# Altium schematic sheet P03_ Power Supplies.SchDoc
size A3; SheetNumber: 3; SheetTotal: 7
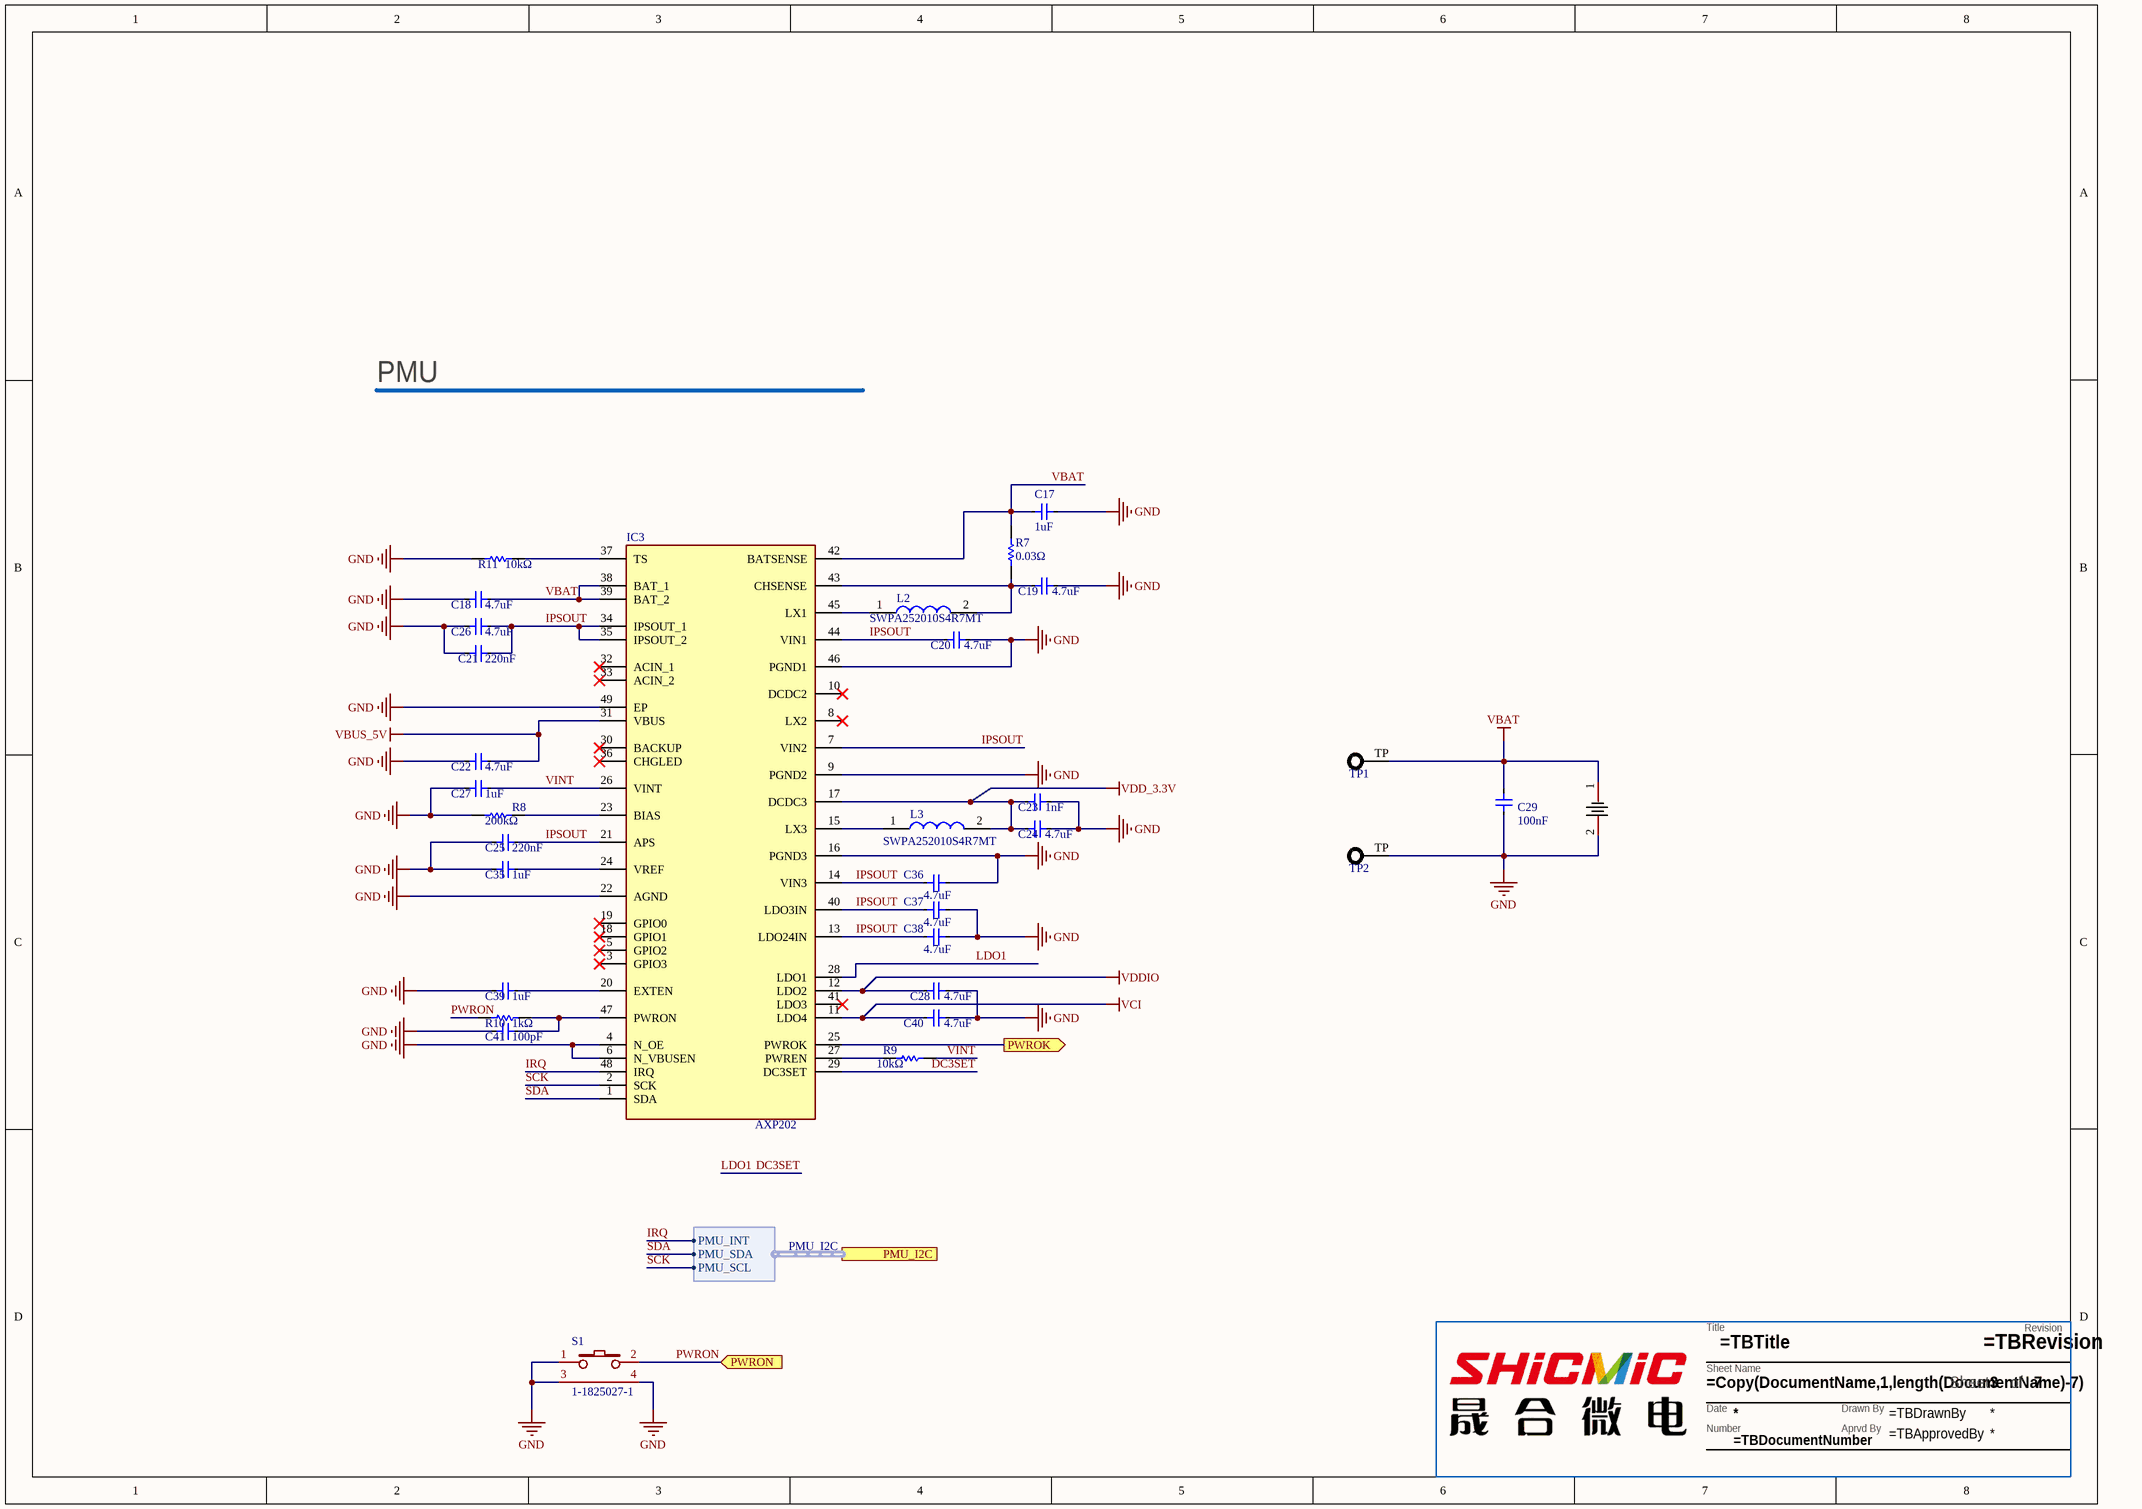
[diagram p0: P03_ Power Supplies.SchDoc]

## Parts
?  TitleBlock  (value not drawn)  (graphical)
BT1  BH-18650-B1BA002  [BATTERY-SMD_18650-1S-L77.1-W20.7-1]  (value not drawn)
C17  1uF  [CAP_0402]
C18  4.7uF  [CAP_0402]
C19  4.7uF  [CAP_0402]
C20  4.7uF  [CAP_0402]
C21  220nF  [CAP_0402]
C22  4.7uF  [CAP_0402]
C23  1nF  [CAP_0402]
C24  4.7uF  [CAP_0402]
C25  220nF  [CAP_0402]
C26  4.7uF  [CAP_0402]
C27  1uF  [CAP_0402]
C28  4.7uF  [CAP_0402]
C29  100nF  [CAP_0402]
C35  1uF  [CAP_0402]
C36  4.7uF  [CAP_0402]
C37  4.7uF  [CAP_0402]
C38  4.7uF  [CAP_0402]
C39  1uF  [CAP_0402]
C40  4.7uF  [CAP_0402]
C41  100pF  [CAP_0402]
IC3  AXP202  [QFN40P600X600X80-49N-D]
L2  SWPA252010S4R7MT  [SWPA252010S4R7MT]
L3  SWPA252010S4R7MT  [SWPA252010S4R7MT]
R7  0.03Ω  [RESC2013X58N]
R8  200kΩ  [RES_0402]
R9  10kΩ  [RES_0402]
R10  1kΩ  [RES_0402]
R11  10kΩ  [RES_0402]
S1  1-1825027-1  [1825027-5]
TP1  PAD  [TPPAD_1.0mm]  (value not drawn)  (no BOM)
TP2  PAD  [TPPAD_1.0mm]  (value not drawn)  (no BOM)

## Ports
PMU_I2C (harness PMU_I2C), PWROK (out), PWRON (in)

## Harnesses
PMU_I2C: PMU_SCL, PMU_SDA, PMU_INT

## Nets
GND: BT1.2 C17.1 C18.1 C19.1 C20.1 C21.1 C22.1 C23.1 C24.1 C25.1 C26.1 C27.1 C28.1 C29.2 C35.1 C36.1 C37.1 C38.1 C39.1 C40.1 C41.1 IC3.4(N_OE) IC3.6(N_VBUSEN) IC3.9(PGND2) IC3.16(PGND3) IC3.22(AGND) IC3.46(PGND1) IC3.49(EP) R8.1 R11.1 S1.1 S1.3(MH1) S1.4(MH2) TP2.TP
VBAT: BT1.1 C17.2 C18.2 C29.1 IC3.38(BAT_1) IC3.39(BAT_2) IC3.42(BATSENSE) R7.2 TP1.TP
VBUS_5V: C22.2 IC3.31(VBUS)
VCI: C40.2 IC3.11(LDO4)
VDD_3.3V: C23.2 C24.2 IC3.17(DCDC3) L3.2
VDDIO: C28.2 IC3.12(LDO2)
DC3SET: IC3.28(LDO1) IC3.29(DC3SET)  [also labelled LDO1]
IPSOUT: C20.2 C21.2 C25.2 C26.2 C36.2 C37.2 C38.2 IC3.7(VIN2) IC3.13(LDO24IN) IC3.14(VIN3) IC3.21(APS) IC3.34(IPSOUT_1) IC3.35(IPSOUT_2) IC3.40(LDO3IN) IC3.44(VIN1)
IRQ: IC3.48(IRQ) ; port PMU_I2C.PMU_INT
PWROK: IC3.25(PWROK) ; port PWROK
PWRON: R10.1 S1.2 ; port PWRON
SCK: IC3.2(SCK) ; port PMU_I2C.PMU_SCL
SDA: IC3.1(SDA) ; port PMU_I2C.PMU_SDA
VINT: C27.2 IC3.26(VINT) R9.1
NetC19_2: C19.2 IC3.43(CHSENSE) L2.2 R7.1
NetC35_2: C35.2 IC3.24(VREF)
NetC39_2: C39.2 IC3.20(EXTEN)
NetC41_2: C41.2 IC3.47(PWRON) R10.2
NetIC3_15: IC3.15(LX3) L3.1
NetIC3_23: IC3.23(BIAS) R8.2
NetIC3_27: IC3.27(PWREN) R9.2
NetIC3_37: IC3.37(TS) R11.2
NetIC3_45: IC3.45(LX1) L2.1

Not connected (* = marked no-connect by the designer): IC3 3(GPIO3)* 5(GPIO2)* 8(LX2)* 10(DCDC2)* 18(GPIO1)* 19(GPIO0)* 30(BACKUP)* 32(ACIN_1)* 33(ACIN_2)* 36(CHGLED)* 41(LDO3)*

## Notes on the sheet
- PMU
- (in symbol TitleBlock) Revision; Title; Sheet Name; Sheet; of; Date; Drawn By; Number; Aprvd By

## Library data of the parts
? = TitleBlock: Title block for Ambiq Schematics. Please have the following parameters entered in Project>Project Options>Parameters: / TBTitle / TBDocumentNumber / TBRevision / TBDrawnBy / TBApprovedBy; AMBIQ PN: TitleBlock
BT1 = BH-18650-B1BA002: Manufacturer: MYOUNG(美阳); Add into BOM: yes; Connector Type: 电池盒; Battery Type: 18650; Name: BH-18650-B1BA002; Symbol: BH-18650-B1BA002; Device: BH-18650-B1BA002; LCSC Part Name: 电池盒 适用电池:18650; Supplier Part: C2988620; Manufacturer Part: BH-18650-B1BA002; Supplier Footprint: SMD; JLCPCB Part Class: Extended Part; Datasheet: https://atta.szlcsc.com/upload/public/pdf/source/20220402/870DB99AB50CA0DF8D51CF7C86A51FAB.pdf; Supplier: LCSC; Convert to PCB: yes
C17-C28 C35-C41 = Capacitor: NONE; Manufacturer: Samsung; AMBIQ PN: CL05A225KP5NNNC; Capacitance: 2.2uF; Tolerance: 10%; Voltage Rating: 10V; Supplier 1: Arrow Electronics; Supplier Part Number 1: CL05A225KP5NNNC; Manufacturer Part Number: CL05A225KP5NNNC; RoHS: Yes; Category: Ceramic Capacitors; Stock 1: 32414; Pricing 1: 1=0.14620, 10=0.09980, 25=0.09880, 100=0.05200, 250=0.05150, 500=0.03630, 1000=0.02990, 3000=0.02760, 6000=0.02610, 15000=0.023; Mount: Surface Mount; Case/Package: 0402; Case Code (Metric): 1005; Case Code (Imperial): 0402; Min Operating Temperature: -55°C; Max Operating Temperature: 85°C; Packaging: Tape and Reel; Voltage Rating (DC): 10V; Series: CL; Length: 0.039inch; Width: 0.02inch; Thickness: 0.022inch; RoHS Compliant: Yes; ComponentLink1URL: https://datasheet.ciiva.com/25727/cl05a225kp5nnnc-25727777.pdf?src-supplier=Digi-Key; ComponentLink1Description: https://datasheet.ciiva.com/25727/cl05a225kp5nnnc-25727777.pdf?src-supplier=Digi-Key; Package Quantity: 1
C29 = Capacitor: NONE; Manufacturer: Kyocera AVX; AMBIQ PN: 0201ZD104KAT2A; Tolerance: 10%; Voltage Rating: 10V; Supplier 1: Arrow Electronics; Supplier Part Number 1: 0201ZD104KAT2A; Manufacturer Part Number: 0201ZD104KAT2A; RoHS: Yes; Category: Ceramic Capacitors; Stock 1: 105000; Pricing 1: 15000=0.00770, 30000=0.00750, 45000=0.00740, 60000=0.00720, 75000=0.00690, 150000=0.00620 (USD); Mount: Surface Mount; Case/Package: 0201; Case Code (Metric): 0603; Case Code (Imperial): 0201; Min Operating Temperature: -55°C; Max Operating Temperature: 85°C; Capacitance: 100nF; Packaging: Tape and Reel; Voltage Rating (DC): 10V; Series: -; Lead Free: Lead Free; RoHS Compliant: Yes; ComponentLink1URL: http://www.mouser.com/ds/2/40/cx5r-776519.pdf?src-supplier=Mouser; ComponentLink1Description: http://www.mouser.com/ds/2/40/cx5r-776519.pdf?src-supplier=Mouser
IC3 = AXP202: Integrated Circuit; Manufacturer_Name: X-Powers; Datasheet Link: http://www.x-powers.com/en.php/Info/down/id/55; Height: 0.8mm; Manufacturer_Part_Number: AXP202
L2 L3 = SWPA252010S4R7MT: Inductor; Manufacturer_Name: SUNLORD; Datasheet Link: https://www.sunlordinc.com/Download.aspx?file=L1VwbG9hZEZpbGVzL1BERl9DYXQvMjAyMjA2MDcxMDAxMzg2MzEucGRm&lan=en; Height: 1mm; Manufacturer_Part_Number: SWPA252010S4R7MT
R7 = WSL0805R0300FEA18: Resistor; Manufacturer_Name: Vishay; Datasheet Link: https://www.vishay.com/docs/31057/wslhigh.pdf; Height: 0.584mm; Manufacturer_Part_Number: WSL0805R0300FEA18; Mouser Part Number: 71-WSL0805R0300FEA18; Mouser Price/Stock: https://www.mouser.co.uk/ProductDetail/Vishay-Dale/WSL0805R0300FEA18?qs=Dk6UgDv3OKgnZ05Ewij84g%3D%3D
R8-R11 = Resistor: Surface Mount Thick Film Resistor, Rc Series, 10 Kohm, 62.5 Mw, - 1%, 50 V, 0402 [1005 Metric]; Manufacturer: Yageo; AMBIQ PN: RC0402FR-0710KL; Resistance: 10kR; Power Rating: 62.5mW; Voltage Rating: 50V; Max Power Dissipation: 63mW; Temperature Coefficient: 100ppm/°C; Supplier 1: Arrow Electronics; Supplier Part Number 1: RC0402FR-0710KL; Manufacturer Part Number: RC0402FR-0710KL; RoHS: Yes; Category: Chip SMD Resistors; Stock 1: 7776428; Pricing 1: 10000=0.00210 (USD); Case/Package: 0402; Case Code (Metric): 1005; Case Code (Imperial): 0402; Min Operating Temperature: -55°C; Max Operating Temperature: 155°C; Packaging: Tape and Reel; Resistor Type: Thick Film; Number of Terminations: 2; Termination: SMD/SMT; Voltage Rating (DC): 50V; Features: Moisture Resistant; Series: RC; Construction: Rectangular; Length: 1mm; Width: 0.5mm; Height: 0.32mm; Depth: 0.5mm; REACH SVHC: No SVHC; Military Standard: Not; Lead Free: Lead Free; RoHS Compliant: Yes; ComponentLink1URL: https://datasheet.ciiva.com/7660/38568-7660787.pdf?src-supplier=Element14; ComponentLink1Description: https://datasheet.ciiva.com/7660/38568-7660787.pdf?src-supplier=Element14; ComponentLink2URL: https://datasheet.ciiva.com/7849/1686128-7849814.pdf?src-supplier=Element14; ComponentLink2Description: https://datasheet.ciiva.com/7849/1686128-7849814.pdf?src-supplier=Element14; ComponentLink3URL: https://datasheet.ciiva.com/7983/1018594-7983486.pdf?src-supplier=Element14; Tolerance: 1%; Number of Pins: 2; Resistance Tolerance: 1%; Working Voltage: 50V; Lead Pitch: 0.2mm
S1 = 1-1825027-1: Switch; Manufacturer_Name: TE Connectivity; Manufacturer_Part_Number: FSMRA4JH04; Datasheet Link: https://www.te.com/commerce/DocumentDelivery/DDEController?Action=srchrtrv&DocNm=1308111-1_SWITCHES_CORE_PROGRAM_CATALOG&DocType=CS&DocLang=English; Height: 7.01mm; Mouser Part Number: 506-FSMRA4JH04; Mouser Price/Stock: https://www.mouser.co.uk/ProductDetail/TE-Connectivity-Alcoswitch/FSMRA4JH04?qs=65SUpkGmTbapQKkEnx7SmQ%3D%3D; Arrow Part Number: 1-1825027-1; Arrow Price/Stock: https://www.arrow.com/en/products/1-1825027-1/te-connectivity
TP1 TP2 = TP_PAD: None; AMBIQ PN: TP_PAD